# EAGLE schematic hub (EAGLE 9.6.2)
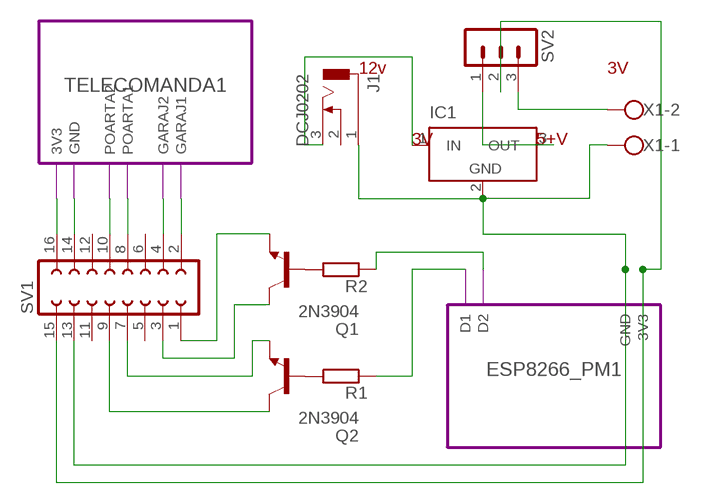
[diagram p0: schematic, sheet 1]

## Parts
IC1  LT1129CST5  [SOT223]
J1  DCJ0202  [DCJ0202]
Q1  2N3904  [TO92]
Q2  2N3904  [TO92]
R1  R-EU_0204/7  [0204/7]
R2  R-EU_0204/7  [0204/7]
SV1  FE08-2W  [FE08-2W]
SV2  MA03-1  [MA03-1]
X1  W237-102  [W237-102]

## Module instances
ESP8266_PM1 = ESP8266_PM
TELECOMANDA1 = TELECOMANDA

## Nets
N$1: R2.1 ; port ESP8266_PM1.D2
N$2: IC1.2(GND) J1.1 SV1.13 X1.1 ; port ESP8266_PM1.GND
N$3: IC1.1(IN) J1.3
N$4: SV2.3 X1.2
N$5: SV1.15 SV2.2 ; port ESP8266_PM1.3V3
N$6: IC1.3(OUT) SV2.1
N$7: Q2.2(B) R1.2
N$8: Q1.2(B) R2.2
N$9: R1.1 ; port ESP8266_PM1.D1
N$10: SV1.2 ; port TELECOMANDA1.GARAJ1
N$11: SV1.4 ; port TELECOMANDA1.GARAJ2
N$12: SV1.8 ; port TELECOMANDA1.POARTA1
N$13: SV1.10 ; port TELECOMANDA1.POARTA2
N$14: SV1.14 ; port TELECOMANDA1.GND
N$15: SV1.16 ; port TELECOMANDA1.3V3
N$16: Q1.3(E) SV1.1
N$17: Q1.1(C) SV1.3
N$18: Q2.3(E) SV1.7
N$19: Q2.1(C) SV1.9
Unconnected: J1.2 SV1.5 SV1.6 SV1.11 SV1.12

## Notes on the sheet
- 12v | 3V
- 3V | 5+V

## Power pins joined to a net without a drawn wire
GND: IC1.4(GND)

## Library data of the parts
IC1 = linear-technology:LT1129CST5: VOLTAGE REGULATOR with shutdown; MPN: LT1129CST-5#PBF; OC_FARNELL: 1663375; OC_NEWARK: 57M2069
J1 = con-jack:DCJ0202: DC POWER JACK Source: DCJ0202.pdf; OC_FARNELL: unknown; OC_NEWARK: unknown
Q1 Q2 = transistor-npn:2N3904: NPN Transistor
R1 R2 = rcl:R-EU_: RESISTOR, European symbol; SPICEPREFIX: R
SV1 = con-lsta:FE08-2W: FEMALE HEADER; OC_FARNELL: unknown; OC_NEWARK: unknown
SV2 = con-lstb:MA03-1: PIN HEADER; OC_FARNELL: unknown; OC_NEWARK: unknown
X1 = con-wago-500:W237-102: WAGO SCREW CLAMP; MPN: 237-102; OC_FARNELL: unknown; OC_NEWARK: 70K9898

## Module ESP8266
Ports: GND(io)

### Library data of the parts

## Module ESP8266_PM
Ports: GND(io) 3V3(io) D1(io) D2(io)

### Library data of the parts

## Module TELECOMANDA
Ports: GARAJ1(io) GARAJ2(io) POARTA1(io) POARTA2(io) GND(io) 3V3(io)

### Library data of the parts